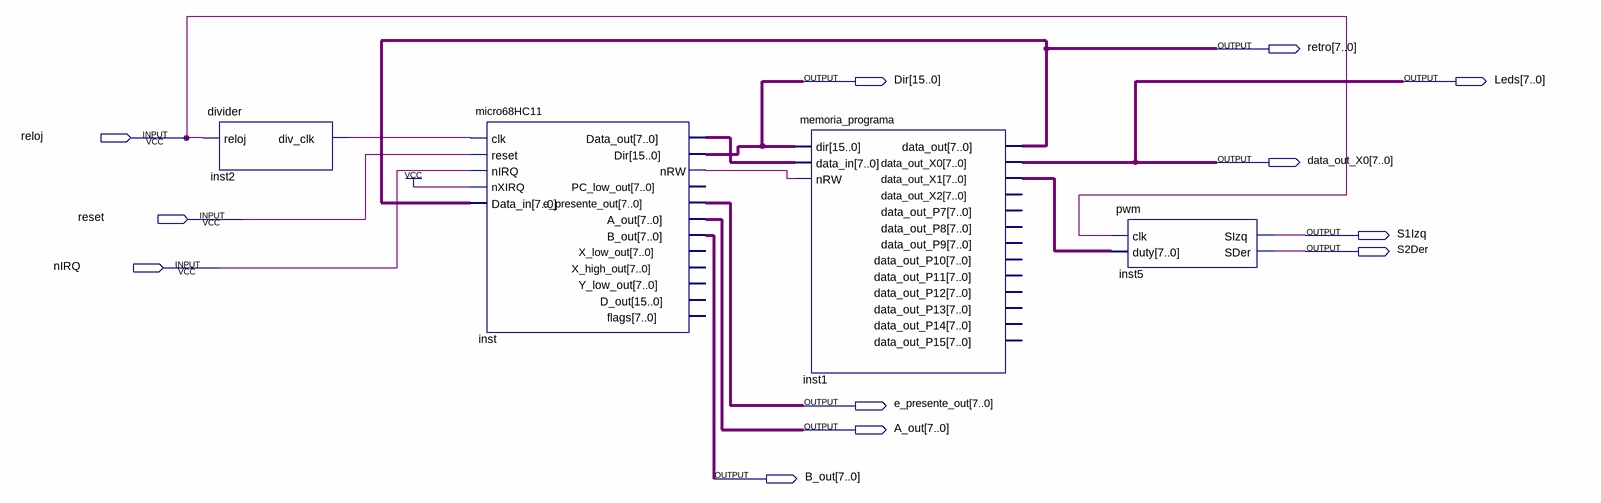
[diagram p0: schematic sheet]
// Quartus schematic PF.bdf as structural Verilog: 4 symbols, 12 pins
module PF (
  input  reloj,
  input  reset,
  input  nIRQ,
  output [7:0] retro,
  output [15:0] Dir,
  output [7:0] Leds,
  output [7:0] data_out_X0,
  output S1Izq,
  output S2Der,
  output [7:0] e_presente_out,
  output [7:0] A_out,
  output [7:0] B_out
);

  wire inst2_div_clk, inst_nrw;
  wire [7:0] inst1_data_out_x1, inst_data_out;

  divider inst2 (.reloj(reloj), .div_clk(inst2_div_clk));
  micro68HC11 inst (
    .clk(inst2_div_clk), .reset(reset), .nIRQ(nIRQ), .nXIRQ(1'b1), .Data_in(retro), .Data_out(inst_data_out),
    .Dir(Dir), .nRW(inst_nrw), .e_presente_out(e_presente_out), .A_out(A_out), .B_out(B_out));  // open: PC_low_out, X_low_out, X_high_out, Y_low_out, D_out, flags
  memoria_programa inst1 (
    .dir(Dir), .data_in(inst_data_out), .nRW(inst_nrw), .data_out(retro), .data_out_X0(data_out_X0),
    .data_out_X1(inst1_data_out_x1));  // open: data_out_X2, data_out_P7, data_out_P8, data_out_P9, data_out_P10, data_out_P11, data_out_P12, data_out_P13, data_out_P14, data_out_P15
  pwm inst5 (.clk(reloj), .duty(inst1_data_out_x1), .SIzq(S1Izq), .SDer(S2Der));

  assign Leds = data_out_X0;
endmodule
